# Altium schematic sheet DS18B20.SchDoc
size A4; SheetNumber: 19; SheetTotal: 21
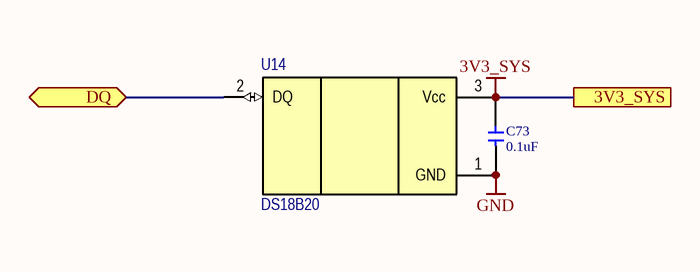
[diagram p0: DS18B20.SchDoc]

## Parts
C73  value 0.1uF  [CERCAP 0402]
U14  DS18B20  [TO-92]

## Ports
3V3_SYS, DQ (bidir)

## Nets
3V3_SYS: C73.2 U14.3(Vcc) ; port 3V3_SYS
GND: C73.1 U14.1(GND)
DQ: U14.2(DQ) ; port DQ

## Library data of the parts
C73 = !Capacitor: Capacitor; IsSMT: NoSMT; Voltage: 50V; Diel: X7R
U14 = DS18B20: Temp; IsSMT: NoSMT